# EasyEDA schematic SCH_Gadget Geocache_2024-01-20.json
TITLE: Gadget Geocache; REV: 1.0; Date: 2024-01-20; Sheet: 1/1; Drawn By: ari224; Company: Ari Designs
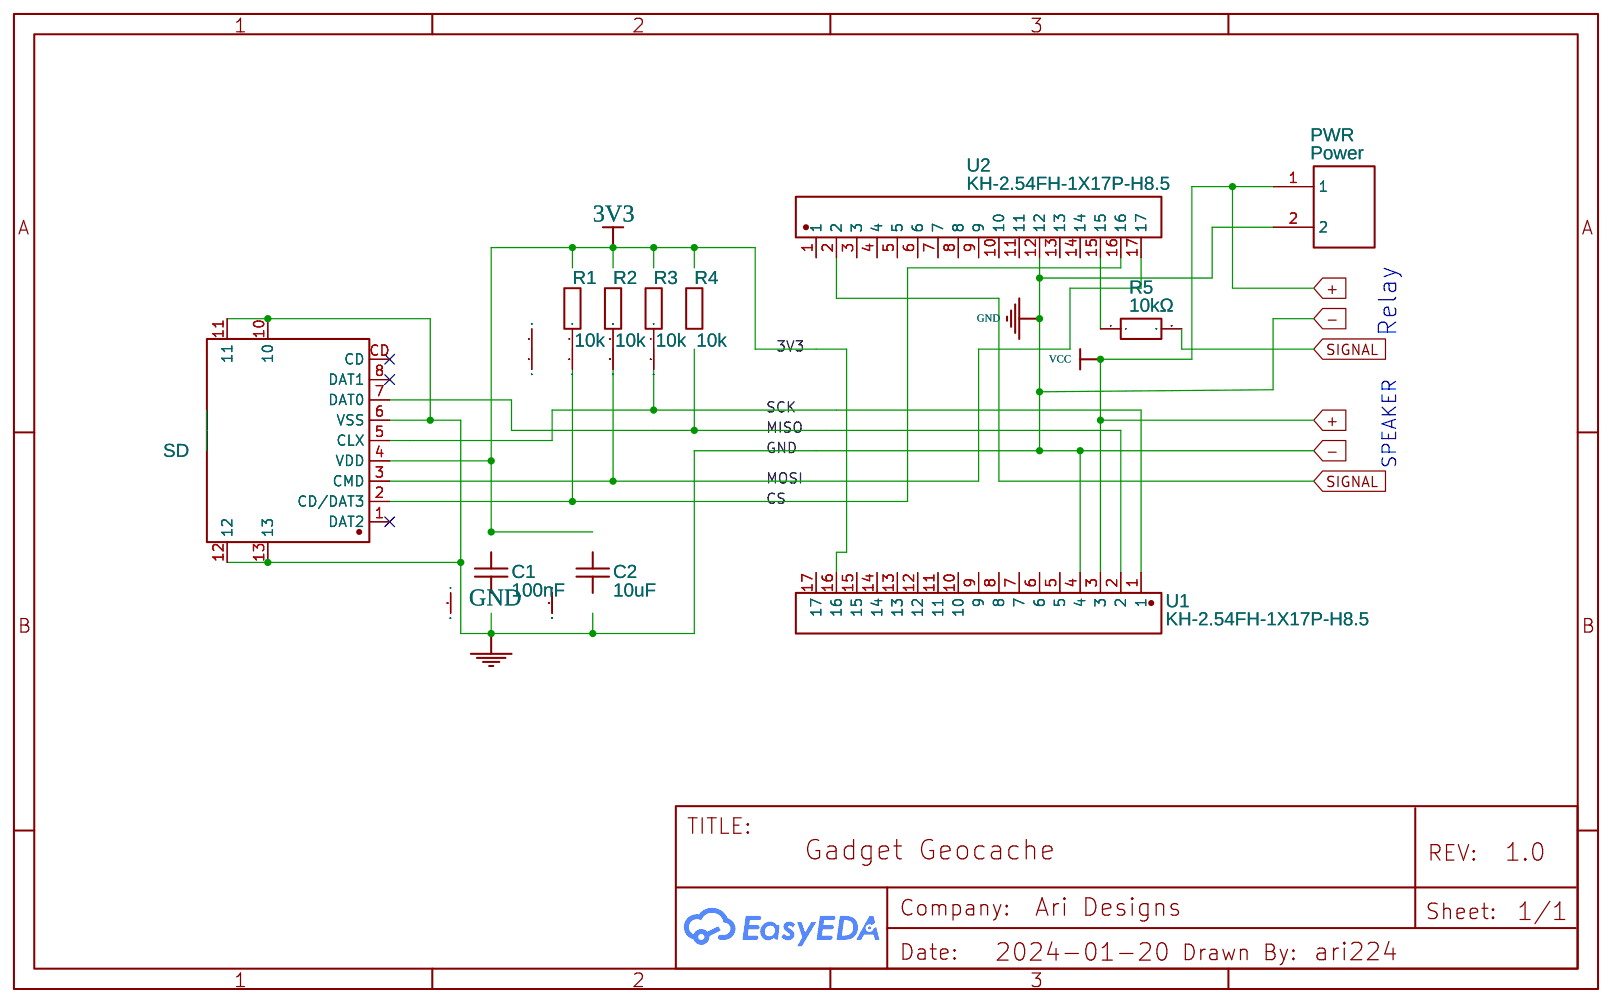
[diagram p0: schematic sheet]

## Parts
C1  100nF  [3-0603]
C2  10uF  [3-0603]
PWR  Power  [CONN-TH_2P-P5.00_WJ128V-5.0-2P]
R1  10k  [3-0603]
R2  10k  [3-0603]
R3  10k  [3-0603]
R4  10k  [3-0603]
R5  10kΩ  [R0603]
SD  SD  [TF-SMD_TF-012]
U1  KH-2.54FH-1X17P-H8.5  [HDR-TH_17P-P2.54-V-F]
U2  KH-2.54FH-1X17P-H8.5  [HDR-TH_17P-P2.54-V-F]

## Library data of the parts
C1 = Capacitor: Manufacturer Part: CC0603KRX7R9BB104; Supplier: LCSC; Manufacturer: YAGEO(国巨); Supplier Part: C14663
C2 = Capacitor: Manufacturer Part: CL10A106MA8NRNC; Supplier: LCSC; Manufacturer: SAMSUNG(三星); Supplier Part: C96446
PWR = WJ128V-5.0-2P: Supplier: LCSC; Manufacturer: KANGNEX(康奈克斯电气); Supplier Part: C8269; JLCPCB Part Class: Extended Part
R1-R4 = Resistor: Manufacturer Part: 0603WAF1002T5E; Supplier: LCSC; Manufacturer: UNI-ROYAL(厚声); Supplier Part: C25804
R5 = SCR0603J10K: Supplier: LCSC; Supplier Part: C3017715; Manufacturer: VO(翔胜); JLCPCB Part Class: Extended Part; Contributor: lcsc
SD = TF-012: Contributor: LCSC; Supplier: LCSC; Supplier Part: C410350; Manufacturer: HANBO(汉博); JLCPCB Part Class: Extended Part
U1 U2 = KH-2.54FH-1X17P-H8.5: Contributor: LCSC; Supplier: LCSC; Supplier Part: C2932677; Manufacturer: kinghelm(金航标); JLCPCB Part Class: Extended Part

## Nets
3V3: C1.2 C2.2 R1.2 R2.2 R3.2 R4.2 SD.4(VDD) U1.16
+: PWR.1 U1.3
-: C1.1 C2.1 PWR.2 SD.6(VSS) SD.10 SD.11 SD.12 SD.13 U1.4 U2.12
CS: R1.1 SD.2(CD/DAT3) U2.16
MISO: R4.1 SD.7(DAT0) U1.2
MOSI: R2.1 SD.3(CMD) U2.17
SCK: R3.1 SD.5(CLX) U1.1
SIGNAL: R5.2 U2.2
Net-(R5-1): R5.1 U2.15

Not connected (* = marked no-connect by the designer): SD 1(DAT2)* 8(DAT1)* CD*; U1 5 6 7 8 9 10 11 12 13 14 15 17; U2 1 3 4 5 6 7 8 9 10 11 13 14

## Notes on the sheet
- Relay
- SPEAKER
